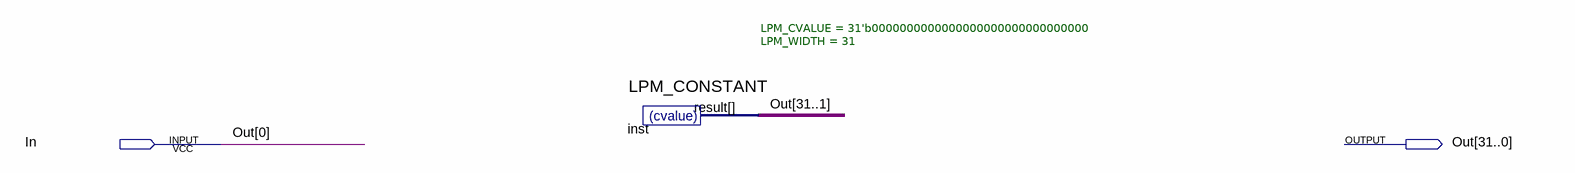
[diagram p0: schematic sheet]
// Quartus schematic ZeroExtend.bdf as structural Verilog: 1 symbols, 2 pins
module ZeroExtend (
  input  In,
  output [31:0] Out
);

  LPM_CONSTANT #(.LPM_CVALUE(31'b0000000000000000000000000000000), .LPM_WIDTH(31)) inst (.result(Out[31:1]));

  assign Out[0] = In;
endmodule
